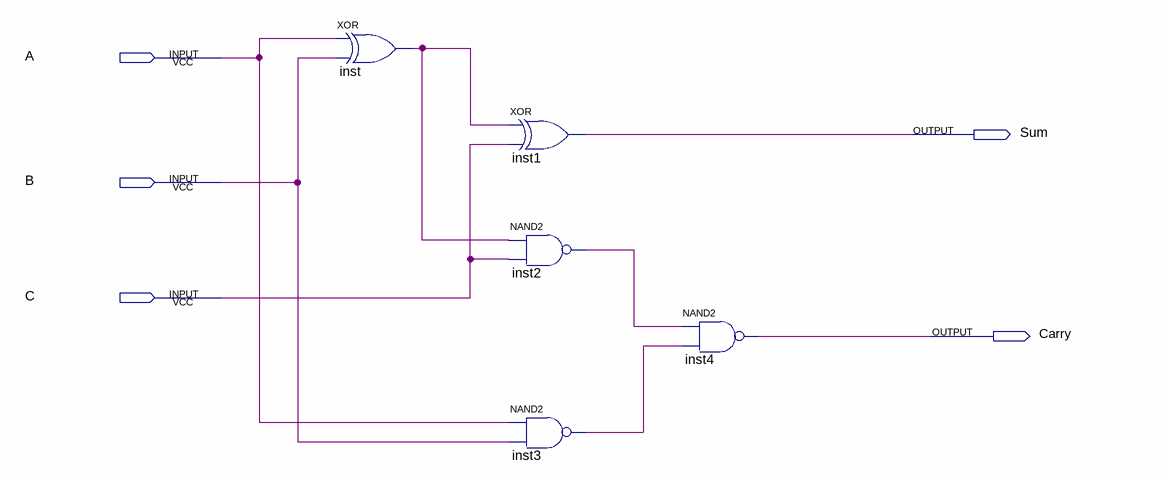
[diagram p0: schematic sheet]
// Quartus schematic fulladder.bdf as structural Verilog: 5 symbols, 5 pins
module fulladder (
  input  A,
  input  B,
  input  C,
  output Sum,
  output Carry
);

  wire inst2_out, inst3_out, inst_out;

  xor inst (inst_out, A, B);
  xor inst1 (Sum, inst_out, C);
  nand inst2 (inst2_out, inst_out, C);
  nand inst3 (inst3_out, A, B);
  nand inst4 (Carry, inst2_out, inst3_out);
endmodule
